# Altium schematic sheet Soldeerbout_P3.SchDoc: Soldeerbout
size A4; DrawnBy: Boghe Tim; Revision: 01; SheetNumber: 3; SheetTotal: 5; Number: PXL2022-0001
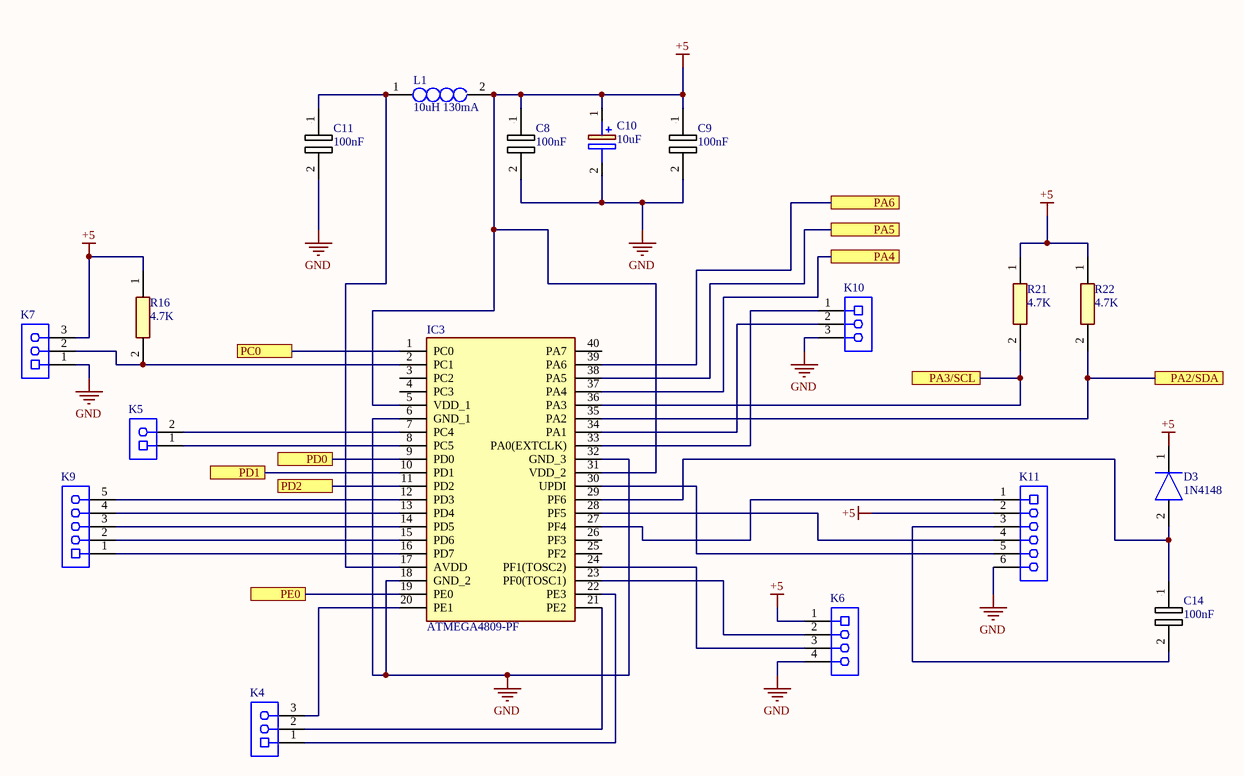
[diagram p0: Soldeerbout_P3.SchDoc]

## Parts
C8  100nF  [0805]
C9  100nF  [0805]
C10  10uF  [C 50V 10µF]
C11  100nF  [0805]
C14  100nF  [0805]
D3  1N4148  [1N4148, 100V 200mA]
IC3  ATMEGA4809-PF  [ic3]
K4  61300311821  [61300311821]  (value not drawn)
K5  61300211821  [61300211821]  (value not drawn)
K6  61300411821  [61300411821]  (value not drawn)
K7  61300311821  [61300311821]  (value not drawn)
K9  61300511821  [61300511821]  (value not drawn)
K10  61300311821  [61300311821]  (value not drawn)
K11  61300611821  [61300611821]  (value not drawn)
L1  10uH 130mA  [L1 10uH 130mA]
R16  4.7K  [0805]
R21  4.7K  [0805]
R22  4.7K  [0805]

## Ports
PA2/SDA, PA3/SCL, PA4, PA5, PA6, PC0, PD0, PD1, PD2, PE0

## Nets
+5: C8.1 C9.1 C10.1(+) D3.1(K) IC3.5(VDD_1) IC3.31(VDD_2) K6.1 K7.3 K11.2 L1.2 R16.1 R21.1 R22.1
GND: C8.2 C9.2 C10.2(-) C11.2 IC3.6(GND_1) IC3.18(GND_2) IC3.32(GND_3) K6.4 K7.1 K10.3 K11.6
PA2/SDA: IC3.35(PA2) R22.2 ; port PA2/SDA
PA3/SCL: IC3.36(PA3) R21.2 ; port PA3/SCL
PA4: IC3.37(PA4) ; port PA4
PA5: IC3.38(PA5) ; port PA5
PA6: IC3.39(PA6) ; port PA6
PC0: IC3.1(PC0) ; port PC0
PD0: IC3.9(PD0) ; port PD0
PD1: IC3.10(PD1) ; port PD1
PD2: IC3.11(PD2) ; port PD2
PE0: IC3.19(PE0) ; port PE0
NetC11_1: C11.1 IC3.17(AVDD) L1.1
NetC14_1: C14.1 D3.2(A) IC3.29(PF6)
NetC14_2: C14.2 K11.3
NetIC3_2: IC3.2(PC1) K7.2 R16.2
NetIC3_7: IC3.7(PC4) K5.2
NetIC3_8: IC3.8(PC5) K5.1
NetIC3_12: IC3.12(PD3) K9.5
NetIC3_13: IC3.13(PD4) K9.4
NetIC3_14: IC3.14(PD5) K9.3
NetIC3_15: IC3.15(PD6) K9.2
NetIC3_16: IC3.16(PD7) K9.1
NetIC3_20: IC3.20(PE1) K4.3
NetIC3_21: IC3.21(PE2) K4.2
NetIC3_22: IC3.22(PE3) K4.1
NetIC3_23: IC3.23(PF0(TOSC1)) K6.2
NetIC3_24: IC3.24(PF1(TOSC2)) K6.3
NetIC3_27: IC3.27(PF4) K11.1
NetIC3_28: IC3.28(PF5) K11.4
NetIC3_30: IC3.30(UPDI) K11.5
NetIC3_33: IC3.33(PA0(EXTCLK)) K10.1
NetIC3_34: IC3.34(PA1) K10.2

Not connected (* = marked no-connect by the designer): IC3 3(PC2) 4(PC3) 25(PF2) 26(PF3) 40(PA7)

## Library data of the parts
C8 C9 C11 C14 = ESR10EZPJ183_1: Resistor; Manufacturer_Name: ROHM Semiconductor; Datasheet Link: https://datasheet.datasheetarchive.com/originals/distributors/Datasheets_SAMA/30ccb516c688c96e56c83a00b77a93f4.pdf; Height: 0.65mm; Manufacturer_Part_Number: ESR10EZPJ183
C10 = ESS106M050AE2AA: Capacitor Polarised; Manufacturer_Name: Kemet; Datasheet Link: https://content.kemet.com/datasheets/KEM_A4057_ESS.pdf; Height: 8.5mm; Manufacturer_Part_Number: ESS106M050AE2AA
D3 = 1N4148: Diode; Manufacturer_Name: Nexperia; Datasheet Link: https://datasheet.datasheetarchive.com/originals/distributors/Datasheets-112/DSAP0040891.pdf; Manufacturer_Part_Number: 1N4148
IC3 = ATMEGA4809-PF: Integrated Circuit; Manufacturer_Name: Microchip; Datasheet Link: https://componentsearchengine.com//ATMEGA4809-PF.pdf; Height: 6.35mm; Mouser2 Part Number: 556-ATMEGA4809-PF; Mouser2 Price/Stock: https://www.mouser.com/Search/Refine.aspx?Keyword=556-ATMEGA4809-PF; Manufacturer_Part_Number: ATMEGA4809-PF
K4 K7 K10 = 61300311821: WR-PHD Socket Header, THT, pitch 2.54mm, Single Row, Vertical, 3p; Manufacturer: Wurth Elektronik; Pin Number: 3; Rated Current: 3A; Working Voltage: 250VAC; Withstanding Voltage: 500VAC; Contact Resistance: 20mOhm; ComponentLink1Description: Manufacturer; ComponentLink1URL: http://www.we-online.de; ComponentLink2Description: Datasheet; ComponentLink2URL: https://www.we-online.com/catalog/datasheet/61300311821.pdf; Manufacturer Part Number: 61300311821; Pitch: 2.54mm; Operating Temperature: -40 to +125degC; Mounting Technology: THT; Packaging: Tray; Gender: Socket Header; Row Number: Single; Orientation: Vertical
K5 = 61300211821: WR-PHD Socket Header, THT, pitch 2.54mm, Single Row, Vertical, 2p; Manufacturer: Wurth Elektronik; Pin Number: 2; Rated Current: 3A; Working Voltage: 250VAC; Withstanding Voltage: 500VAC; Contact Resistance: 20mOhm; ComponentLink1Description: Manufacturer; ComponentLink1URL: http://www.we-online.de; ComponentLink2Description: Datasheet; ComponentLink2URL: https://www.we-online.com/catalog/datasheet/61300211821.pdf; Manufacturer Part Number: 61300211821; Pitch: 2.54mm; Operating Temperature: -40 to +125degC; Mounting Technology: THT; Packaging: Tray; Gender: Socket Header; Row Number: Single; Orientation: Vertical
K6 = 61300411821: WR-PHD Socket Header, THT, pitch 2.54mm, Single Row, Vertical, 4p; Manufacturer: Wurth Elektronik; Pin Number: 4; Rated Current: 3A; Working Voltage: 250VAC; Withstanding Voltage: 500VAC; Contact Resistance: 20mOhm; ComponentLink1Description: Manufacturer; ComponentLink1URL: http://www.we-online.de; ComponentLink2Description: Datasheet; ComponentLink2URL: https://www.we-online.com/catalog/datasheet/61300411821.pdf; Manufacturer Part Number: 61300411821; Pitch: 2.54mm; Operating Temperature: -40 to +125degC; Mounting Technology: THT; Packaging: Tray; Gender: Socket Header; Row Number: Single; Orientation: Vertical
K9 = 61300511821: WR-PHD Socket Header, THT, pitch 2.54mm, Single Row, Vertical, 5p; Manufacturer: Wurth Elektronik; Pin Number: 5; Rated Current: 3A; Working Voltage: 250VAC; Withstanding Voltage: 500VAC; Contact Resistance: 20mOhm; ComponentLink1Description: Manufacturer; ComponentLink1URL: http://www.we-online.de; ComponentLink2Description: Datasheet; ComponentLink2URL: https://www.we-online.com/catalog/datasheet/61300511821.pdf; Manufacturer Part Number: 61300511821; Pitch: 2.54mm; Operating Temperature: -40 to +125degC; Mounting Technology: THT; Packaging: Tray; Gender: Socket Header; Row Number: Single; Orientation: Vertical
K11 = 61300611821: WR-PHD Socket Header, THT, pitch 2.54mm, Single Row, Vertical, 6p; Manufacturer: Wurth Elektronik; Pin Number: 6; Rated Current: 3A; Working Voltage: 250VAC; Withstanding Voltage: 500VAC; Contact Resistance: 20mOhm; ComponentLink1Description: Manufacturer; ComponentLink1URL: http://www.we-online.de; ComponentLink2Description: Datasheet; ComponentLink2URL: https://www.we-online.com/catalog/datasheet/61300611821.pdf; Manufacturer Part Number: 61300611821; Pitch: 2.54mm; Operating Temperature: -40 to +125degC; Mounting Technology: THT; Packaging: Tray; Gender: Socket Header; Row Number: Single; Orientation: Vertical
L1 = 78F100J-RC: Inductor; Manufacturer_Name: Bourns; Datasheet Link: https://componentsearchengine.com//78F100J-RC.pdf; Mouser2 Part Number: 542-78F100-RC; Mouser2 Price/Stock: https://www.mouser.com/Search/Refine.aspx?Keyword=542-78F100-RC; Manufacturer_Part_Number: 78F100J-RC
R16 R21 R22 = ESR10EZPJ183: Resistor; Manufacturer_Name: ROHM Semiconductor; Datasheet Link: https://datasheet.datasheetarchive.com/originals/distributors/Datasheets_SAMA/30ccb516c688c96e56c83a00b77a93f4.pdf; Height: 0.65mm; Manufacturer_Part_Number: ESR10EZPJ183